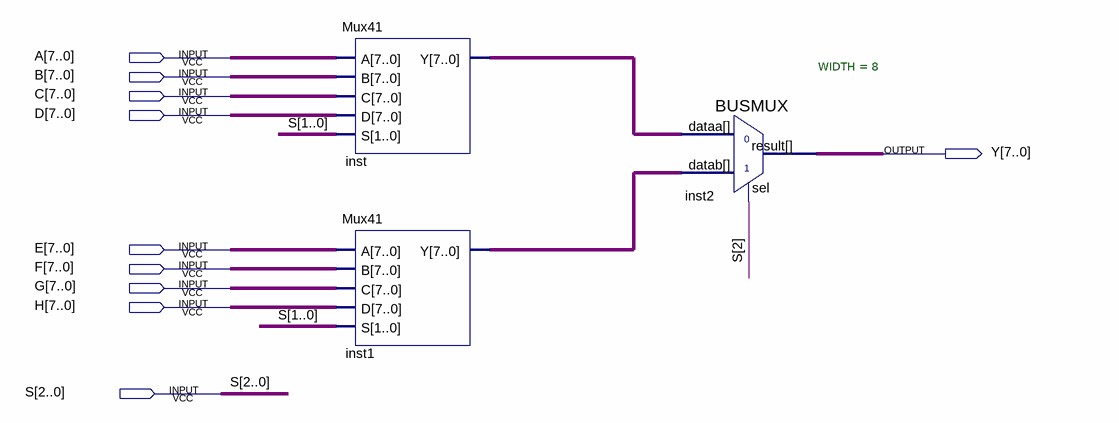
[diagram p0: schematic sheet]
// Quartus schematic Mux81.bdf as structural Verilog: 3 symbols, 10 pins
module Mux81 (
  input  [7:0] A,
  input  [7:0] B,
  input  [7:0] C,
  input  [7:0] D,
  input  [7:0] E,
  input  [7:0] F,
  input  [7:0] G,
  input  [7:0] H,
  input  [2:0] S,
  output [7:0] Y
);

  wire [7:0] inst1_y, inst_y;

  Mux41 inst (.A(A), .B(B), .C(C), .D(D), .S(S[1:0]), .Y(inst_y));
  Mux41 inst1 (.A(E), .B(F), .C(G), .D(H), .S(S[1:0]), .Y(inst1_y));
  BUSMUX #(.WIDTH(8)) inst2 (.datab(inst1_y), .sel(S[2]), .dataa(inst_y), .result(Y));
endmodule
